# Altium project 001.botom.PrjPcb
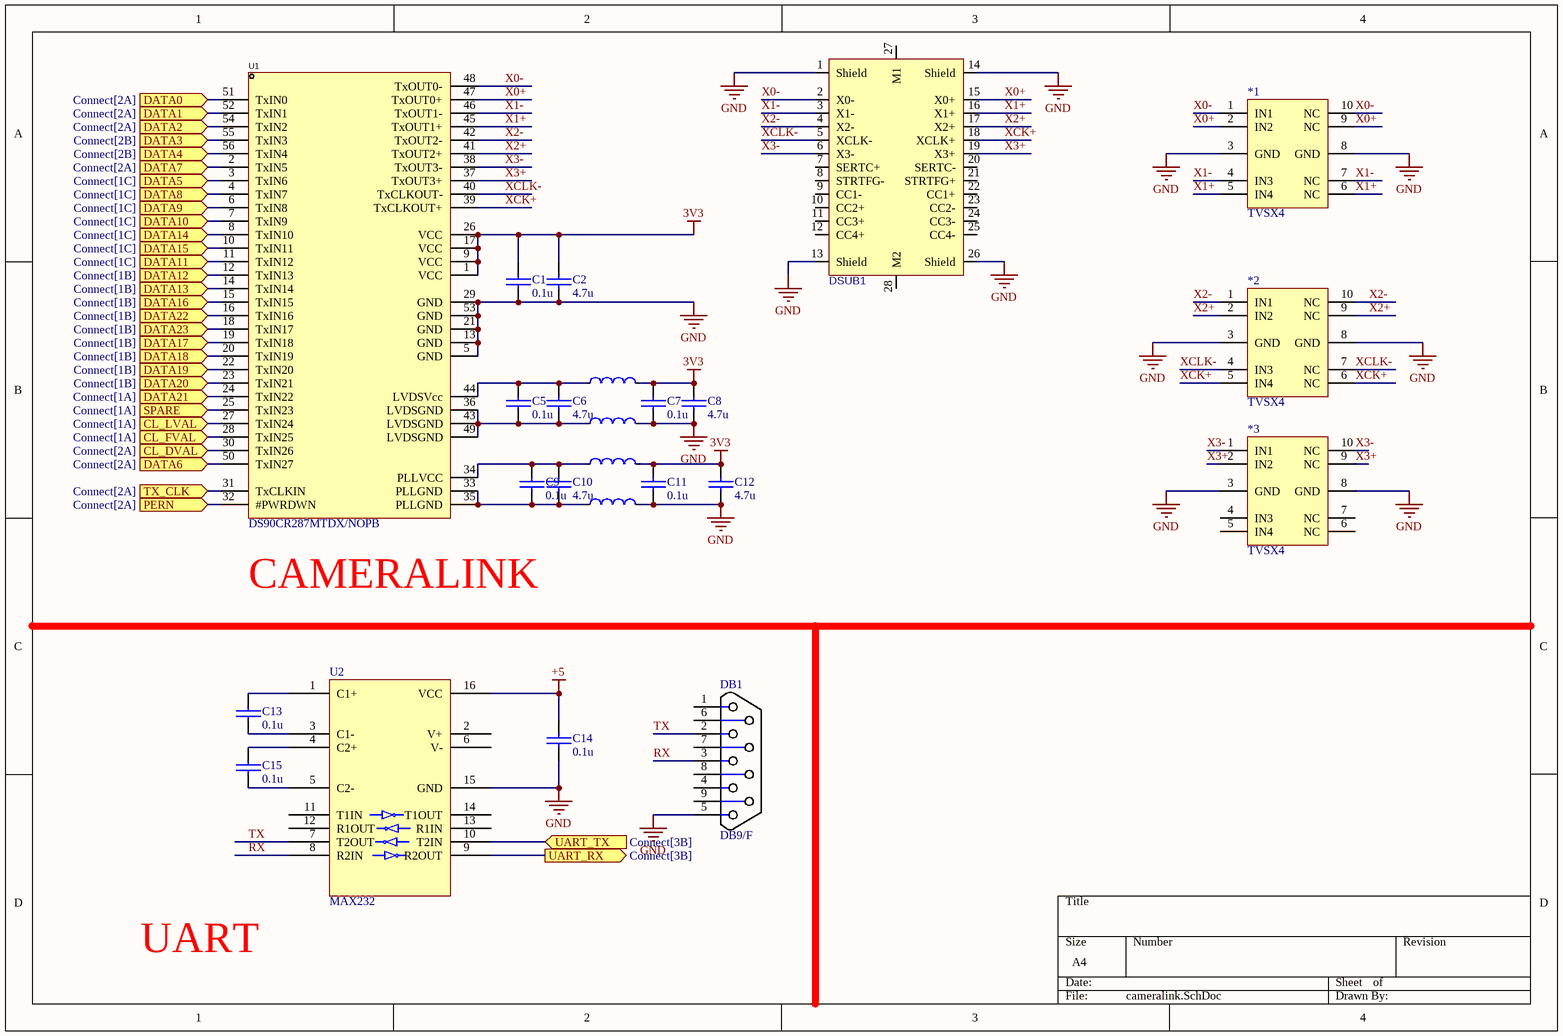
[diagram p0: cameralink.SchDoc]
3 sheets, 86 parts. Net scope: flat (ports and power ports of the same name join across sheets).
Board file: ccd_bottom.PcbDoc
Sheets:
  cameralink.SchDoc
  power.SchDoc
  Connect.SchDoc

## Sheet cameralink.SchDoc
size A4; SheetNumber: 1; SheetTotal: 3

### Parts
*1  TVSX4  [DFN-10]
*2  TVSX4  [DFN-10]
*3  TVSX4  [DFN-10]
C1  0.1u  [0603C]
C2  4.7u  [0603C]
C5  0.1u  [0603C]
C6  4.7u  [0603C]
C7  0.1u  [0603C]
C8  4.7u  [0603C]
C9  0.1u  [0603C]
C10  4.7u  [0603C]
C11  0.1u  [0603C]
C12  4.7u  [0603C]
C13  0.1u  [0603C]
C14  0.1u  [0603C]
C15  0.1u  [0603C]
DB1  DB9/F  [DB9/F/90]
DSUB1  6321-026RDS1MWA02  [MDR-26-horizontal]  (value not drawn)
L3  GZ1608D601TF  [0603L]  (value not drawn)
L4  GZ1608D601TF  [0603L]  (value not drawn)
L5  GZ1608D601TF  [0603L]  (value not drawn)
L6  GZ1608D601TF  [0603L]  (value not drawn)
U1  DS90CR287MTDX/NOPB  [TSSOP-56]
U2  MAX232  [SOP16]

### Ports
CL_DVAL (in, see Connect[2A]), CL_FVAL (in, see Connect[1A]), CL_LVAL (in, see Connect[1A]), DATA0 (in, see Connect[2A]), DATA1 (in, see Connect[2A]), DATA2 (in, see Connect[2A]), DATA3 (in, see Connect[2B]), DATA4 (in, see Connect[2B]), DATA5 (in, see Connect[1C]), DATA6 (in, see Connect[2A]), DATA7 (in, see Connect[2A]), DATA8 (in, see Connect[1C]), DATA9 (in, see Connect[1C]), DATA10 (in, see Connect[1C]), DATA11 (in, see Connect[1C]), DATA12 (in, see Connect[1B]), DATA13 (in, see Connect[1B]), DATA14 (in, see Connect[1C]), DATA15 (in, see Connect[1C]), DATA16 (in, see Connect[1B]), DATA17 (in, see Connect[1B]), DATA18 (in, see Connect[1B]), DATA19 (in, see Connect[1B]), DATA20 (in, see Connect[1B]), DATA21 (in, see Connect[1A]), DATA22 (in, see Connect[1B]), DATA23 (in, see Connect[1B]), PERN (in, see Connect[2A]), SPARE (in, see Connect[1A]), TX_CLK (in, see Connect[2A]), UART_RX (out, see Connect[3B]), UART_TX (in, see Connect[3B])

### Nets
3V3: C1.2 C2.2 C7.2 C8.2 C11.2 C12.2 L3.2 L5.2 U1.1(VCC) U1.9(VCC) U1.17(VCC) U1.26(VCC)
+5: C14.2 U2.16(VCC)
GND: *1.3(GND) *1.8(GND) *2.3(GND) *2.8(GND) *3.3(GND) *3.8(GND) C1.1 C2.1 C7.1 C8.1 C11.1 C12.1 C14.1 DB1.5 DSUB1.1(Shield) DSUB1.13(Shield) DSUB1.14(Shield) DSUB1.26(Shield) L4.2 L6.2 U1.5(GND) U1.13(GND) U1.21(GND) U1.29(GND) U1.53(GND) U2.15(GND)
B13_L3_N: U1.22(TxIN20) ; port DATA19
B13_L3_P: U1.23(TxIN21) ; port DATA20
B13_L5_N: U1.27(TxIN24) ; port CL_LVAL
B13_L5_P: U1.28(TxIN25) ; port CL_FVAL
B13_L7_N: U1.24(TxIN22) ; port DATA21
B13_L7_P: U1.25(TxIN23) ; port SPARE
B15_L14_N: U1.51(TxIN0) ; port DATA0
B15_L14_P: U1.50(TxIN27) ; port DATA6
B15_L16_N: U2.9(R2OUT) ; port UART_RX
B15_L16_P: U2.10(T2IN) ; port UART_TX
B15_L19_N: U1.30(TxIN26) ; port CL_DVAL
B15_L19_P: U1.2(TxIN5) ; port DATA7
B15_L20_N: U1.32(#PWRDWN) ; port PERN
B15_L20_P: U1.31(TxCLKIN) ; port TX_CLK
B15_L21_N: U1.54(TxIN2) ; port DATA2
B15_L21_P: U1.52(TxIN1) ; port DATA1
B15_L24_N: U1.56(TxIN4) ; port DATA4
B15_L24_P: U1.55(TxIN3) ; port DATA3
B16_L1_N: U1.12(TxIN13) ; port DATA12
B16_L1_P: U1.11(TxIN12) ; port DATA11
B16_L4_N: U1.10(TxIN11) ; port DATA15
B16_L4_P: U1.8(TxIN10) ; port DATA14
B16_L6_N: U1.7(TxIN9) ; port DATA10
B16_L6_P: U1.6(TxIN8) ; port DATA9
B16_L8_N: U1.3(TxIN6) ; port DATA5
B16_L8_P: U1.4(TxIN7) ; port DATA8
B34_L18_N: U1.18(TxIN17) ; port DATA23
B34_L18_P: U1.16(TxIN16) ; port DATA22
B34_L19_N: U1.14(TxIN14) ; port DATA13
B34_L19_P: U1.15(TxIN15) ; port DATA16
B34_L23_N: U1.19(TxIN18) ; port DATA17
B34_L23_P: U1.20(TxIN19) ; port DATA18
RX: DB1.3 U2.8(R2IN)
TX: DB1.2 U2.7(T2OUT)
X0+: *1.2(IN2) *1.9(NC) DSUB1.15(X0+) U1.47(TxOUT0+)
X0-: *1.1(IN1) *1.10(NC) DSUB1.2(X0-) U1.48(TxOUT0-)
X1+: *1.5(IN4) *1.6(NC) DSUB1.16(X1+) U1.45(TxOUT1+)
X1-: *1.4(IN3) *1.7(NC) DSUB1.3(X1-) U1.46(TxOUT1-)
X2+: *2.2(IN2) *2.9(NC) DSUB1.17(X2+) U1.41(TxOUT2+)
X2-: *2.1(IN1) *2.10(NC) DSUB1.4(X2-) U1.42(TxOUT2-)
X3+: *3.2(IN2) *3.9(NC) DSUB1.19(X3+) U1.37(TxOUT3+)
X3-: *3.1(IN1) *3.10(NC) DSUB1.6(X3-) U1.38(TxOUT3-)
XCK+: *2.5(IN4) *2.6(NC) DSUB1.18(XCLK+) U1.39(TxCLKOUT+)
XCLK-: *2.4(IN3) *2.7(NC) DSUB1.5(XCLK-) U1.40(TxCLKOUT-)
NetC5_1: C5.1 C6.1 L4.1 U1.36(LVDSGND) U1.43(LVDSGND) U1.49(LVDSGND)
NetC5_2: C5.2 C6.2 L3.1 U1.44(LVDSVcc)
NetC9_1: C9.1 C10.1 L6.1 U1.33(PLLGND) U1.35(PLLGND)
NetC9_2: C9.2 C10.2 L5.1 U1.34(PLLVCC)
NetC13_1: C13.1 U2.3(C1-)
NetC13_2: C13.2 U2.1(C1+)
NetC15_1: C15.1 U2.5(C2-)
NetC15_2: C15.2 U2.4(C2+)

Not connected (* = marked no-connect by the designer): *3 4(IN3) 5(IN4) 6(NC) 7(NC); DB1 1 4 6 7 8 9; DSUB1 7(SERTC+) 8(STRTFG-) 9(CC1-) 10(CC2+) 11(CC3+) 12(CC4+) 20(SERTC-) 21(STRTFG+) 22(CC1+) 23(CC2-) 24(CC3-) 25(CC4-) 27(M1) 28(M2); U2 2(V+) 6(V-) 11(T1IN) 12(R1OUT) 13(R1IN) 14(T1OUT)

### Notes on the sheet
- (near U1) CAMERALINK
- UART

### Library data of the parts
*1-*3 = TVSX4: 瞬态抑制二极管
C1 C2 C5-C15 = CAP: 无极性电容
DSUB1 = MDR-26: BOM_Manufacturer: Wcon; Contributor: LCSC; BOM_Supplier: LCSC; BOM_Supplier Part: C843200; BOM_Manufacturer Part: 6321-026RDS1MWA02; BOM_JLCPCB Part Class: Extended Part; spicePre: D; spiceSymbolName: 6321-026RDS1MWA02
L3-L6 = FB: 铁氧体磁珠; Manufacturer: Sunlord(顺络); Add into BOM: yes; Impedance @ Frequency: 600Ω@100MHz; Tolerance: ±25%; DC Resistance: 450mΩ; Current Rating: 200mA; Circuits: 1; Name: GZ1608D601TF; Symbol: GZ1608D601TF; Device: GZ1608D601TF; LCSC Part Name: 600Ω@100MHz ±25%; Supplier Part: C1002; Manufacturer Part: GZ1608D601TF; Supplier Footprint: 0603; JLCPCB Part Class: Basic Part; Datasheet: https://atta.szlcsc.com/upload/public/pdf/source/20210830/355EA7C0FAC5394FC0FE3F17C770C20A.pdf; Supplier: LCSC; Convert to PCB: yes
U1 = DS90CR287MTDX/NOPB: cameralink编码; Manufacturer: TI(德州仪器); Add into BOM: yes; Name: DS90CR287MTDX/NOPB; Symbol: DS90CR287MTDX/NOPB; Device: DS90CR287MTDX/NOPB; LCSC Part Name: DS90CR287MTDX/NOPB; Supplier Part: C87059; Manufacturer Part: DS90CR287MTDX/NOPB; Supplier Footprint: TSSOP-56; JLCPCB Part Class: Extended Part; Datasheet: https://atta.szlcsc.com/upload/public/pdf/source/20181012/C87059_649258B21BE4DAB0D862C5E1E6C719D7.pdf; Supplier: LCSC; Convert to PCB: yes

## Sheet power.SchDoc
size A4; SheetNumber: 2; SheetTotal: 3
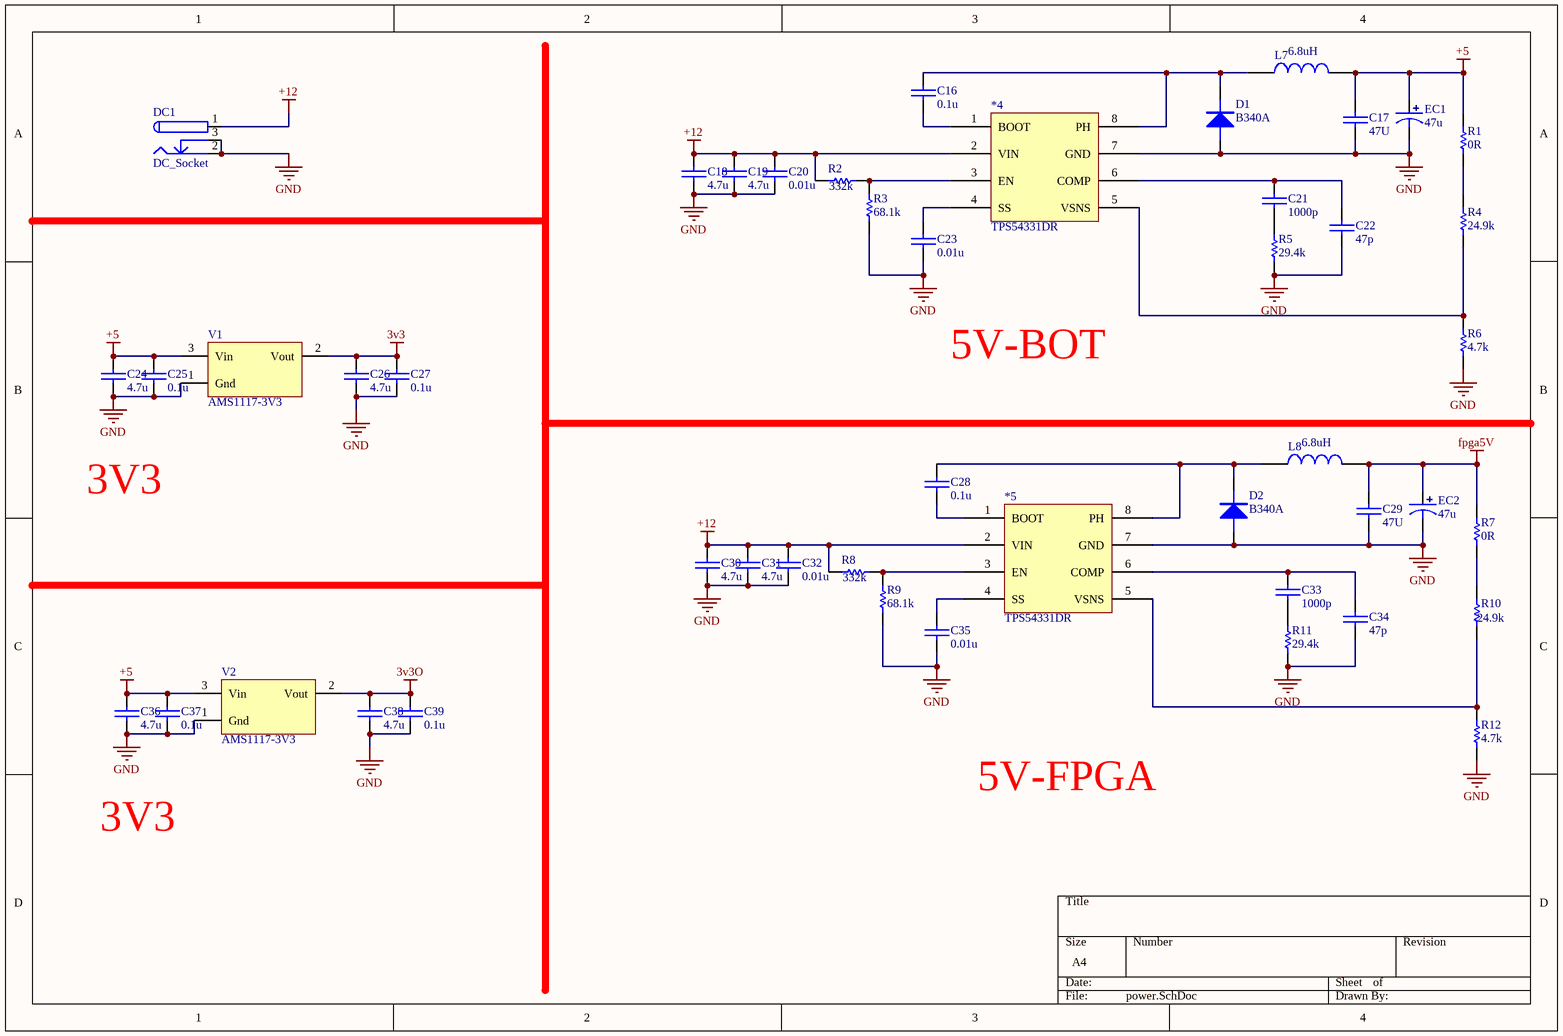
[diagram p1: power.SchDoc]

### Parts
*4  TPS54331DR  [SOIC-8]
*5  TPS54331DR  [SOIC-8]
C16  0.1u  [0603C]
C17  47U  [0603C]
C18  4.7u  [0603C]
C19  4.7u  [0603C]
C20  0.01u  [0603C]
C21  1000p  [0603C]
C22  47p  [0603C]
C23  0.01u  [0603C]
C24  4.7u  [0603C]
C25  0.1u  [0603C]
C26  4.7u  [0603C]
C27  0.1u  [0603C]
C28  0.1u  [0603C]
C29  47U  [0603C]
C30  4.7u  [0603C]
C31  4.7u  [0603C]
C32  0.01u  [0603C]
C33  1000p  [0603C]
C34  47p  [0603C]
C35  0.01u  [0603C]
C36  4.7u  [0603C]
C37  0.1u  [0603C]
C38  4.7u  [0603C]
C39  0.1u  [0603C]
D1  B340A  [SMA/DO-214AC]
D2  B340A  [SMA/DO-214AC]
DC1  DC_Socket  [DC-005]
EC1  47u  [SMD-EC6.3X6.3X10]
EC2  47u  [SMD-EC6.3X6.3X10]
L7  6.8uH  [L-SMD-0630]
L8  6.8uH  [L-SMD-0630]
R1  0R  [0603R]
R2  332k  [0603R]
R3  68.1k  [0603R]
R4  24.9k  [0603R]
R5  29.4k  [0603R]
R6  4.7k  [0603R]
R7  0R  [0603R]
R8  332k  [0603R]
R9  68.1k  [0603R]
R10  24.9k  [0603R]
R11  29.4k  [0603R]
R12  4.7k  [0603R]
V1  AMS1117-3V3  [SOT223_L]
V2  AMS1117-3V3  [SOT223_L]

### Nets
3V3: C26.2 C27.2 V1.2(Vout)
3v3O: C38.2 C39.2 V2.2(Vout)
+5: C17.2 C24.2 C25.2 C36.2 C37.2 EC1.1 L7.2 R1.2 V1.3(Vin) V2.3(Vin)
+12: *4.2(VIN) *5.2(VIN) C18.2 C19.2 C20.2 C30.2 C31.2 C32.2 DC1.1 R2.2 R8.2
fpga5V: C29.2 EC2.1 L8.2 R7.2
GND: *4.7(GND) *5.7(GND) C17.1 C18.1 C19.1 C20.1 C22.1 C23.1 C24.1 C25.1 C26.1 C27.1 C29.1 C30.1 C31.1 C32.1 C34.1 C35.1 C36.1 C37.1 C38.1 C39.1 D1.A D2.A DC1.2 DC1.3 EC1.2 EC2.2 R3.1 R5.1 R6.1 R9.1 R11.1 R12.1 V1.1(Gnd) V2.1(Gnd)
Net*4_1: *4.1(BOOT) C16.1
Net*4_3: *4.3(EN) R2.1 R3.2
Net*4_4: *4.4(SS) C23.2
Net*4_5: *4.5(VSNS) R4.1 R6.2
Net*4_6: *4.6(COMP) C21.2 C22.2
Net*4_8: *4.8(PH) C16.2 D1.K L7.1
Net*5_1: *5.1(BOOT) C28.1
Net*5_3: *5.3(EN) R8.1 R9.2
Net*5_4: *5.4(SS) C35.2
Net*5_5: *5.5(VSNS) R10.1 R12.2
Net*5_6: *5.6(COMP) C33.2 C34.2
Net*5_8: *5.8(PH) C28.2 D2.K L8.1
NetC21_1: C21.1 R5.2
NetC33_1: C33.1 R11.2
NetR1_1: R1.1 R4.2
NetR7_1: R7.1 R10.2

### Notes on the sheet
- 5V-BOT
- 3V3
- 5V-FPGA

### Library data of the parts
*4 *5 = TPS54331DR: 降压型DC-DC
C16-C39 = CAP: 无极性电容
D1 D2 = DIODE: 普通二极管
EC1 EC2 = ECAP: 贴片电解电容
L7 L8 = L: INDUCTOR
R1-R12 = RES: 电阻
V1 V2 = AMS1117: LDO; BOM名称: 稳压芯片; 封装库来自淘宝卖家：黄晶宝石: 其他店铺购入的买家，请立即申请退款，本店现金奖励200~1000元

## Sheet Connect.SchDoc
size A4; SheetNumber: 3; SheetTotal: 3
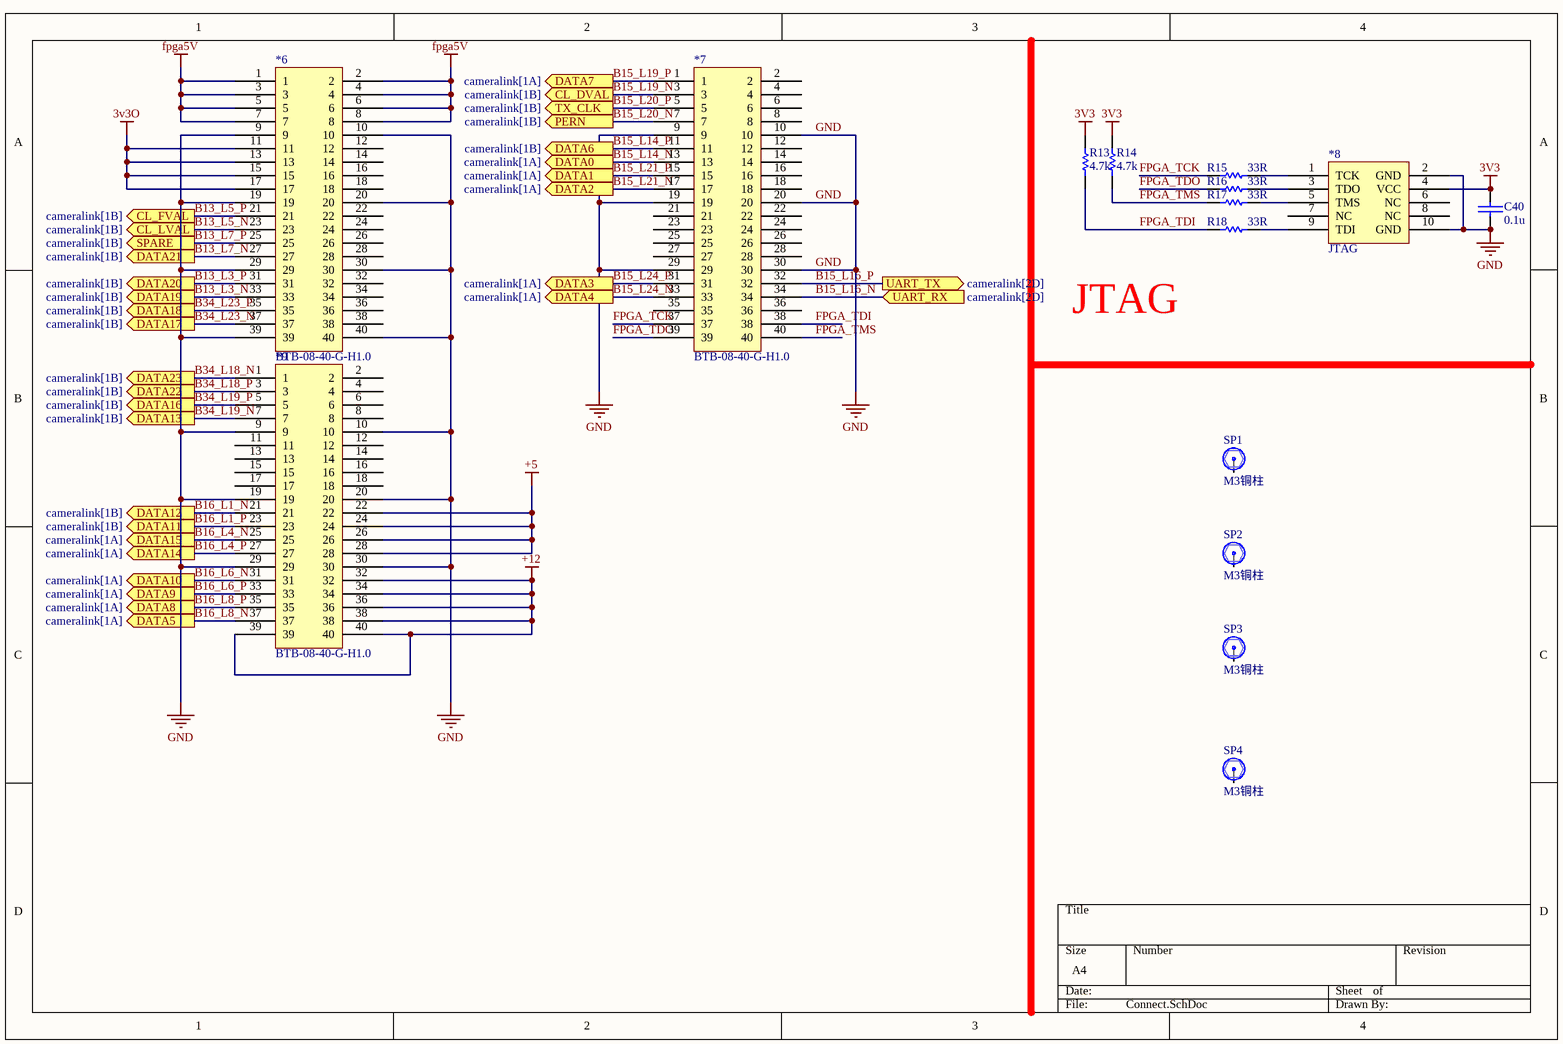
[diagram p2: Connect.SchDoc]

### Parts
*6  BTB-08-40-G-H1.0  [BTB-08-40-M-H1.0]
*7  BTB-08-40-G-H1.0  [BTB-08-40-M-H1.0]
*8  JTAG  [JTAG]
*9  BTB-08-40-G-H1.0  [BTB-08-40-M-H1.0]
C40  0.1u  [0603C]
R13  4.7k  [0603R]
R14  4.7k  [0603R]
R15  33R  [0603R]
R16  33R  [0603R]
R17  33R  [0603R]
R18  33R  [0603R]
SP1  M3铜柱  [M3x4_N]
SP2  M3铜柱  [M3x4_N]
SP3  M3铜柱  [M3x4_N]
SP4  M3铜柱  [M3x4_N]

### Ports
CL_DVAL (out, see cameralink[1B]), CL_FVAL (out, see cameralink[1B]), CL_LVAL (out, see cameralink[1B]), DATA0 (out, see cameralink[1A]), DATA1 (out, see cameralink[1A]), DATA2 (out, see cameralink[1A]), DATA3 (out, see cameralink[1A]), DATA4 (out, see cameralink[1A]), DATA5 (out, see cameralink[1A]), DATA6 (out, see cameralink[1B]), DATA7 (out, see cameralink[1A]), DATA8 (out, see cameralink[1A]), DATA9 (out, see cameralink[1A]), DATA10 (out, see cameralink[1A]), DATA11 (out, see cameralink[1B]), DATA12 (out, see cameralink[1B]), DATA13 (out, see cameralink[1B]), DATA14 (out, see cameralink[1A]), DATA15 (out, see cameralink[1A]), DATA16 (out, see cameralink[1B]), DATA17 (out, see cameralink[1B]), DATA18 (out, see cameralink[1B]), DATA19 (out, see cameralink[1B]), DATA20 (out, see cameralink[1B]), DATA21 (out, see cameralink[1B]), DATA22 (out, see cameralink[1B]), DATA23 (out, see cameralink[1B]), PERN (out, see cameralink[1B]), SPARE (out, see cameralink[1B]), TX_CLK (out, see cameralink[1B]), UART_RX (in, see cameralink[2D]), UART_TX (out, see cameralink[2D])

### Nets
3V3: *8.4(VCC) C40.2 R13.2 R14.2
3v3O: *6.11 *6.13 *6.15 *6.17
+5: *9.22 *9.24 *9.26 *9.28
+12: *9.32 *9.34 *9.36 *9.38 *9.39 *9.40
fpga5V: *6.1 *6.2 *6.3 *6.4 *6.5 *6.6 *6.7 *6.8
GND: *6.9 *6.10 *6.19 *6.20 *6.29 *6.30 *6.39 *6.40 *7.9 *7.10 *7.19 *7.20 *7.29 *7.30 *8.2(GND) *8.10(GND) *9.9 *9.10 *9.19 *9.20 *9.29 *9.30 C40.1
B13_L3_N: *6.33 ; port DATA19
B13_L3_P: *6.31 ; port DATA20
B13_L5_N: *6.23 ; port CL_LVAL
B13_L5_P: *6.21 ; port CL_FVAL
B13_L7_N: *6.27 ; port DATA21
B13_L7_P: *6.25 ; port SPARE
B15_L14_N: *7.13 ; port DATA0
B15_L14_P: *7.11 ; port DATA6
B15_L16_N: *7.34 ; port UART_RX
B15_L16_P: *7.32 ; port UART_TX
B15_L19_N: *7.3 ; port CL_DVAL
B15_L19_P: *7.1 ; port DATA7
B15_L20_N: *7.7 ; port PERN
B15_L20_P: *7.5 ; port TX_CLK
B15_L21_N: *7.17 ; port DATA2
B15_L21_P: *7.15 ; port DATA1
B15_L24_N: *7.33 ; port DATA4
B15_L24_P: *7.31 ; port DATA3
B16_L1_N: *9.21 ; port DATA12
B16_L1_P: *9.23 ; port DATA11
B16_L4_N: *9.25 ; port DATA15
B16_L4_P: *9.27 ; port DATA14
B16_L6_N: *9.31 ; port DATA10
B16_L6_P: *9.33 ; port DATA9
B16_L8_N: *9.37 ; port DATA5
B16_L8_P: *9.35 ; port DATA8
B34_L18_N: *9.1 ; port DATA23
B34_L18_P: *9.3 ; port DATA22
B34_L19_N: *9.7 ; port DATA13
B34_L19_P: *9.5 ; port DATA16
B34_L23_N: *6.37 ; port DATA17
B34_L23_P: *6.35 ; port DATA18
FPGA_TCK: *7.37 R15.1
FPGA_TDI: *7.38 R13.1 R18.1
FPGA_TDO: *7.39 R16.1
FPGA_TMS: *7.40 R14.1 R17.1
Net*8_1: *8.1(TCK) R15.2
Net*8_3: *8.3(TDO) R16.2
Net*8_5: *8.5(TMS) R17.2
Net*8_9: *8.9(TDI) R18.2

Not connected (* = marked no-connect by the designer): *6 12 14 16 18 22 24 26 28 32 34 36 38; *7 2 4 6 8 12 14 16 18 21 22 23 24 25 26 27 28 35 36; *8 6(NC) 7(NC) 8(NC); *9 2 4 6 8 11 12 13 14 15 16 17 18; SP1 1; SP2 1; SP3 1; SP4 1

### Notes on the sheet
- JTAG

### Library data of the parts
C40 = CAP: 无极性电容
R13-R18 = RES: 电阻
SP1-SP4 = 铜柱大焊盘: 铜柱; 版权归属: 封装库来自淘宝 ID：黄晶宝石; BOM名称: 铜柱; 学习资源: https://shop463601444.taobao.com

## Nets that join several sheets
3V3: cameralink (12 pins), power (C26.2 C27.2 V1.2), Connect (*8.4 C40.2 R13.2 R14.2)
3v3O: power (C38.2 C39.2 V2.2), Connect (*6.11 *6.13 *6.15 *6.17)
+5: cameralink (C14.2 U2.16), power (10 pins), Connect (*9.22 *9.24 *9.26 *9.28)
+12: power (11 pins), Connect (6 pins)
fpga5V: power (C29.2 EC2.1 L8.2 R7.2), Connect (8 pins)
GND: cameralink (26 pins), power (36 pins), Connect (23 pins)
B13_L3_N: cameralink (U1.22), Connect (*6.33)
B13_L3_P: cameralink (U1.23), Connect (*6.31)
B13_L5_N: cameralink (U1.27), Connect (*6.23)
B13_L5_P: cameralink (U1.28), Connect (*6.21)
B13_L7_N: cameralink (U1.24), Connect (*6.27)
B13_L7_P: cameralink (U1.25), Connect (*6.25)
B15_L14_N: cameralink (U1.51), Connect (*7.13)
B15_L14_P: cameralink (U1.50), Connect (*7.11)
B15_L16_N: cameralink (U2.9), Connect (*7.34)
B15_L16_P: cameralink (U2.10), Connect (*7.32)
B15_L19_N: cameralink (U1.30), Connect (*7.3)
B15_L19_P: cameralink (U1.2), Connect (*7.1)
B15_L20_N: cameralink (U1.32), Connect (*7.7)
B15_L20_P: cameralink (U1.31), Connect (*7.5)
B15_L21_N: cameralink (U1.54), Connect (*7.17)
B15_L21_P: cameralink (U1.52), Connect (*7.15)
B15_L24_N: cameralink (U1.56), Connect (*7.33)
B15_L24_P: cameralink (U1.55), Connect (*7.31)
B16_L1_N: cameralink (U1.12), Connect (*9.21)
B16_L1_P: cameralink (U1.11), Connect (*9.23)
B16_L4_N: cameralink (U1.10), Connect (*9.25)
B16_L4_P: cameralink (U1.8), Connect (*9.27)
B16_L6_N: cameralink (U1.7), Connect (*9.31)
B16_L6_P: cameralink (U1.6), Connect (*9.33)
B16_L8_N: cameralink (U1.3), Connect (*9.37)
B16_L8_P: cameralink (U1.4), Connect (*9.35)
B34_L18_N: cameralink (U1.18), Connect (*9.1)
B34_L18_P: cameralink (U1.16), Connect (*9.3)
B34_L19_N: cameralink (U1.14), Connect (*9.7)
B34_L19_P: cameralink (U1.15), Connect (*9.5)
B34_L23_N: cameralink (U1.19), Connect (*6.37)
B34_L23_P: cameralink (U1.20), Connect (*6.35)